# Altium schematic sheet mcu.SchDoc: Micromouse aDual
size A
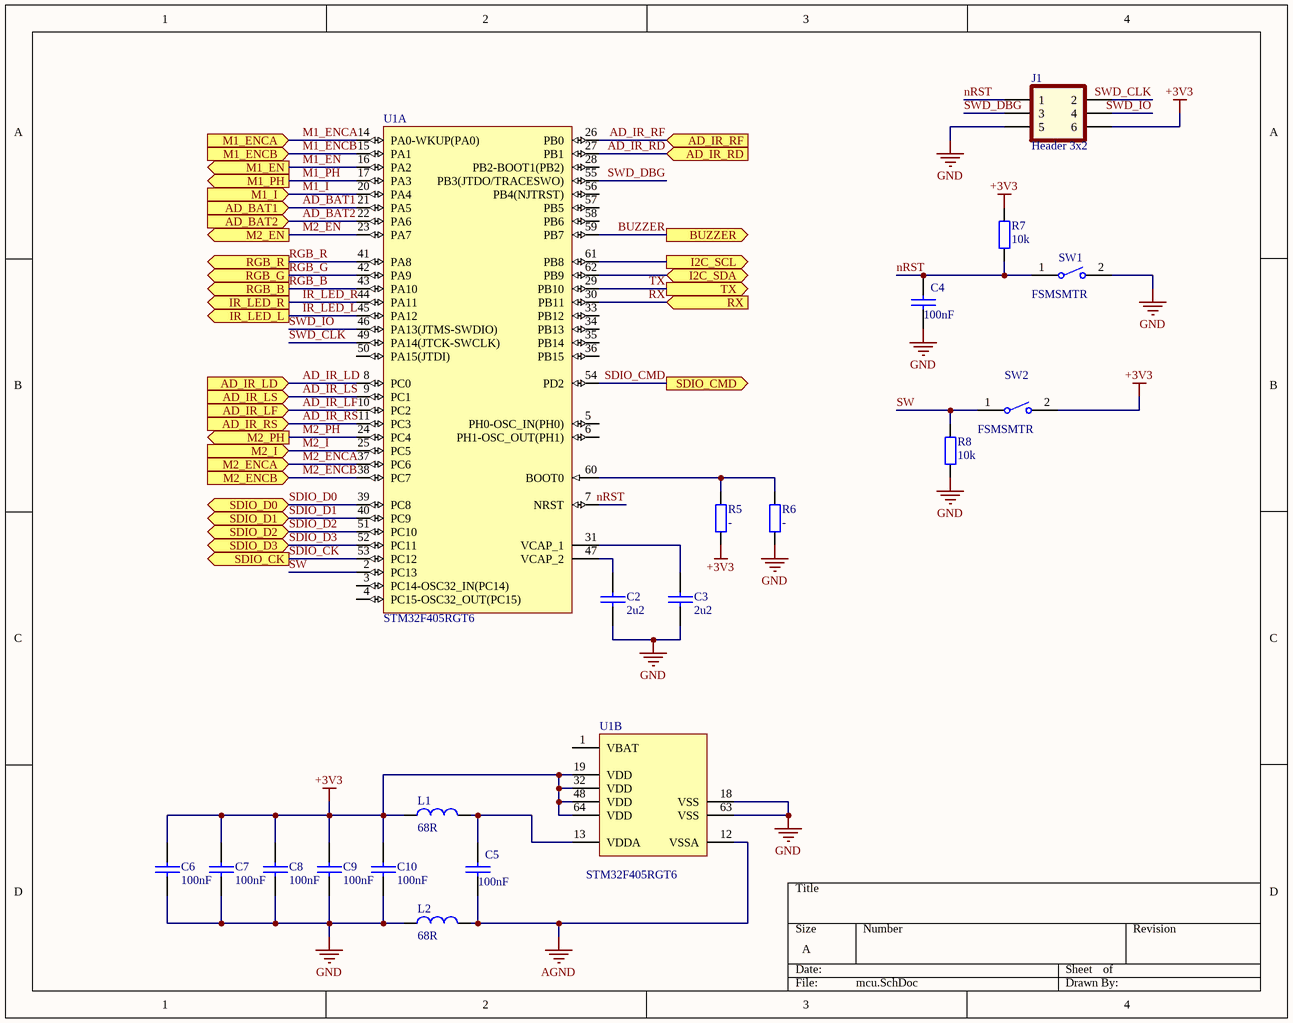
[diagram p0: mcu.SchDoc]

## Parts
C2  2u2  [C0402-Paste]
C3  2u2  [C0402-Paste]
C4  100nF  [C0402-Paste]
C5  100nF  [C0402-Paste]
C6  100nF  [C0402-Paste]
C7  100nF  [C0402-Paste]
C8  100nF  [C0402-Paste]
C9  100nF  [C0402-Paste]
C10  100nF  [C0402-Paste]
J1  Header 3x2  [CON-6x2]
L1  68R  [L0603_PASTE]
L2  68R  [L0603_PASTE]
R5  -  [R0402-Paste]
R6  -  [R0402-Paste]
R7  10k  [R0603_PASTE]
R8  10k  [R0603_PASTE]
SW1  FSMSMTR  [TECO-FSMSMTR_V]
SW2  FSMSMTR  [TECO-FSMSMTR_V]
U1  STM32F405RGT6  [STM-LQFP64_M]  (parts A,B of 2)

## Ports
AD_BAT1 (in), AD_BAT2 (in), AD_IR_LD (in), AD_IR_LF (in), AD_IR_LS (in), AD_IR_RD (in), AD_IR_RF (in), AD_IR_RS (in), BUZZER (out), I2C_SCL (out), I2C_SDA (bidir), IR_LED_L (out), IR_LED_R (out), M1_EN (out), M1_ENCA (in), M1_ENCB (in), M1_I (in), M1_PH (out), M2_EN (out), M2_ENCA (in), M2_ENCB (in), M2_I (in), M2_PH (out), RGB_B (out), RGB_G (out), RGB_R (out), RX (in), SDIO_CK (out), SDIO_CMD (out), SDIO_D0 (bidir), SDIO_D1 (bidir), SDIO_D2 (bidir), SDIO_D3 (bidir), TX (out)

## Nets
+3V3: C6.2 C7.2 C8.2 C9.2 C10.2 J1.6 L1.1 R5.2 R7.1 SW2.2 U1.19(VDD) U1.32(VDD) U1.48(VDD) U1.64(VDD)
AGND: C5.1 L2.2 U1.12(VSSA)
GND: C2.1 C3.1 C4.1 C6.1 C7.1 C8.1 C9.1 C10.1 J1.5 L2.1 R6.2 R8.2 SW1.2 U1.18(VSS) U1.63(VSS)
AD_BAT1: U1.21(PA5) ; port AD_BAT1
AD_BAT2: U1.22(PA6) ; port AD_BAT2
AD_IR_LD: U1.8(PC0) ; port AD_IR_LD
AD_IR_LF: U1.10(PC2) ; port AD_IR_LF
AD_IR_LS: U1.9(PC1) ; port AD_IR_LS
AD_IR_RD: U1.27(PB1) ; port AD_IR_RD
AD_IR_RF: U1.26(PB0) ; port AD_IR_RF
AD_IR_RS: U1.11(PC3) ; port AD_IR_RS
BUZZER: U1.59(PB7) ; port BUZZER
I2C_SCL: U1.61(PB8) ; port I2C_SCL
I2C_SDA: U1.62(PB9) ; port I2C_SDA
IR_LED_L: U1.45(PA12) ; port IR_LED_L
IR_LED_R: U1.44(PA11) ; port IR_LED_R
M1_EN: U1.16(PA2) ; port M1_EN
M1_ENCA: U1.14(PA0-WKUP(PA0)) ; port M1_ENCA
M1_ENCB: U1.15(PA1) ; port M1_ENCB
M1_I: U1.20(PA4) ; port M1_I
M1_PH: U1.17(PA3) ; port M1_PH
M2_EN: U1.23(PA7) ; port M2_EN
M2_ENCA: U1.37(PC6) ; port M2_ENCA
M2_ENCB: U1.38(PC7) ; port M2_ENCB
M2_I: U1.25(PC5) ; port M2_I
M2_PH: U1.24(PC4) ; port M2_PH
nRST: C4.2 J1.1 R7.2 SW1.1 U1.7(NRST)
RGB_B: U1.43(PA10) ; port RGB_B
RGB_G: U1.42(PA9) ; port RGB_G
RGB_R: U1.41(PA8) ; port RGB_R
RX: U1.30(PB11) ; port RX
SDIO_CK: U1.53(PC12) ; port SDIO_CK
SDIO_CMD: U1.54(PD2) ; port SDIO_CMD
SDIO_D0: U1.39(PC8) ; port SDIO_D0
SDIO_D1: U1.40(PC9) ; port SDIO_D1
SDIO_D2: U1.51(PC10) ; port SDIO_D2
SDIO_D3: U1.52(PC11) ; port SDIO_D3
SW: R8.1 SW2.1 U1.2(PC13)
SWD_CLK: J1.2 U1.49(PA14(JTCK-SWCLK))
SWD_DBG: J1.3 U1.55(PB3(JTDO/TRACESWO))
SWD_IO: J1.4 U1.46(PA13(JTMS-SWDIO))
TX: U1.29(PB10) ; port TX
NetC2_2: C2.2 U1.47(VCAP_2)
NetC3_2: C3.2 U1.31(VCAP_1)
NetC5_2: C5.2 L1.2 U1.13(VDDA)
NetR5_1: R5.1 R6.1 U1.60(BOOT0)

Not connected (* = marked no-connect by the designer): U1 1(VBAT) 3(PC14-OSC32_IN(PC14)) 4(PC15-OSC32_OUT(PC15)) 5(PH0-OSC_IN(PH0)) 6(PH1-OSC_OUT(PH1)) 28(PB2-BOOT1(PB2)) 33(PB12) 34(PB13) 35(PB14) 36(PB15) 50(PA15(JTDI)) 56(PB4(NJTRST)) 57(PB5) 58(PB6)

## Library data of the parts
C2-C10 = C-0402: CAP CER 0.1UF 16V Y5V 0402; Manufacturer: Samsung Electro-Mechanics; Manufacturer PN: CL05F104ZO5NNNC; Supplier: digikey.ca
  C2 C3: Value: 2u2
  C4-C10: Value: 100nF
J1 = Header 3x2: CONN HEADER VERT 6POS 2.54MM; Manufacturer: Sullins Connector Solutions; Manufacturer PN: PBC03DAAN; Value: Header 3x2; supplier: digikey.ca
L1 L2 = L-0603: FERRITE BEAD 0603; Manufacturer: Laird-Signal Integrity Products; Manufacturer PN: MI0603J680R-10; Value: 68R; Supplier: digikey.ca
R5 R6 = R-0402: RES SMD 0402; Value: -; Manufacturer: -; Manufacturer PN: -; Supplier: digikey.ca
R7 R8 = R-0603: RES SMD 0603; Value: 10k; Manufacturer: -; Manufacturer PN: -; Supplier: digikey.ca
SW1 SW2 = CMP-2000-07501-1: FSMSM Push Button Switch, 50 mA, -35 to 85 degC, 2-Pin SMD, RoHS, Tape and Reel; Manufacturer: TE Connectivity; Voltage Rating (DC): 24V; Electrical Life: 20000Cycles; Operating Force: 180gf; Switch Travel: 0.25mm; Contact Current Rating: 50mA; Case\/Package: SMD/SMT; Actuator Length: 1.07mm; Throw Configuration: SPST; Actuator Material: Polyamide; Contact Resistance: 100mOhm; Illumination Type: Illuminated; Max Voltage Rating (DC): 12V; Manufacturer URL: http://www.te.com/; Lead Free: LeadFree; Packaging: TapeandReel; Min Operating Temperature: -35degC; Mechanical Life: 20000Cycles; Mount: SurfaceMount; REACH SVHC: Unknown; Package Quantity: 1800; Package Reference: FSMSMTR; RoHSCompliant: true; Max Operating Temperature: 85degC; Orientation: Straight; ELV: Compliant; Datasheet URL: http://www.te.com/commerce/DocumentDelivery/DDEController?Action=showdoc&DocId=Customer+Drawing%7F1437566-3%7FC2%7Fpdf%7FEnglish%7FENG_CD_1437566-3_C2_1437566_3_1_c.dwg.pdf%7F1437566-4; Package Description: 2-Pin Surface Mount Device, Body 6 x 3.5 mm, Pitch 9.19 mm; Current Rating: 50mA; Contact Plating: Silver; Termination: GullWing; Datasheet Version: Rev. C2, 08/2014; Contact Material: Brass; Mounting Technology: SurfaceMount
U1 = CMP-0243-00019-3: ARM Cortex-M4 32-bit MCU+FPU, 210 DMIPS, 1024 kB Flash, 192 kB Internal RAM, 51 I/Os, 64-pin LQFP, -40 to 85 degC, Tray; Manufacturer: STMicroelectronics; Supply Voltage(Vcc) min (V): 1.8; Supply Voltage(Vcc) max (V): 3.6; Internal RAM Size (kB): 192; I/Os (High Current): 51; D/A Converter: 2x12-bit; FLASH Size (Prog) (kB): 1024; Operating Frequency(F) (Processor speed) (MHz): 168; ComponentLink2Description: Datasheet; PackageVersion: Rev. 4, 06/2013; DatasheetVersion: Rev. 4; Core: ARM Cortex-M4; ComponentLink2URL: http://www.st.com/st-web-ui/static/active/en/resource/technical/document/datasheet/DM00037051.pdf; PackageReference: LQFP64; Packing: Tray; ComponentLink1Description: Manufacturer URL; ComponentLink3URL: http://www.st.com/st-web-ui/static/active/en/resource/technical/document/datasheet/DM00037051.pdf; ComponentLink3Description: Package Specification; Mounting Technology: Surface Mount; ComponentLink1URL: http://www.st.com/web/en/home.html; PackageDescription: 64-Pin Low Profile Quad Flat Package, 10 x 10 mm Body, 0.5 mm Pitch; PartNumber: STM32F405RGT6